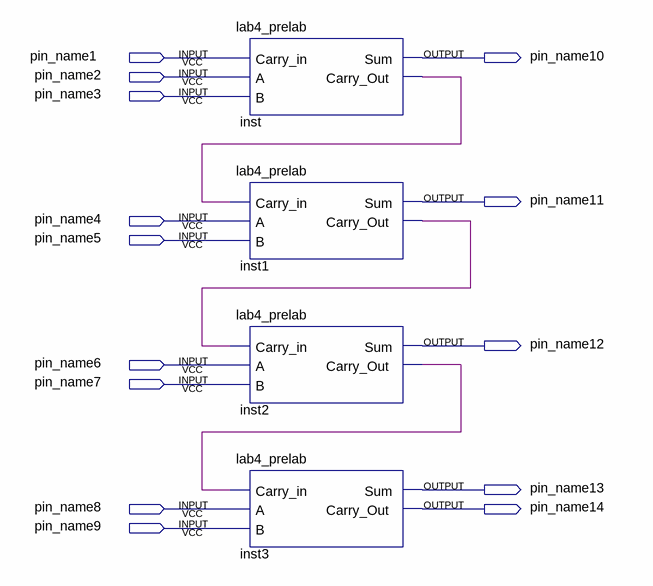
[diagram p0: schematic sheet]
// Quartus schematic 4bitadder.bdf as structural Verilog: 4 symbols, 14 pins
module \4bitadder  (
  input  pin_name1,
  input  pin_name2,
  input  pin_name3,
  input  pin_name4,
  input  pin_name5,
  input  pin_name6,
  input  pin_name7,
  input  pin_name8,
  input  pin_name9,
  output pin_name10,
  output pin_name11,
  output pin_name12,
  output pin_name13,
  output pin_name14
);

  wire inst1_carry_out, inst2_carry_out, inst_carry_out;

  lab4_prelab inst (.Carry_in(pin_name1), .A(pin_name2), .B(pin_name3), .Sum(pin_name10), .Carry_Out(inst_carry_out));
  lab4_prelab inst1 (
    .Carry_in(inst_carry_out), .A(pin_name4), .B(pin_name5), .Sum(pin_name11), .Carry_Out(inst1_carry_out));
  lab4_prelab inst2 (
    .Carry_in(inst1_carry_out), .A(pin_name6), .B(pin_name7), .Sum(pin_name12), .Carry_Out(inst2_carry_out));
  lab4_prelab inst3 (
    .Carry_in(inst2_carry_out), .A(pin_name8), .B(pin_name9), .Sum(pin_name13), .Carry_Out(pin_name14));
endmodule
